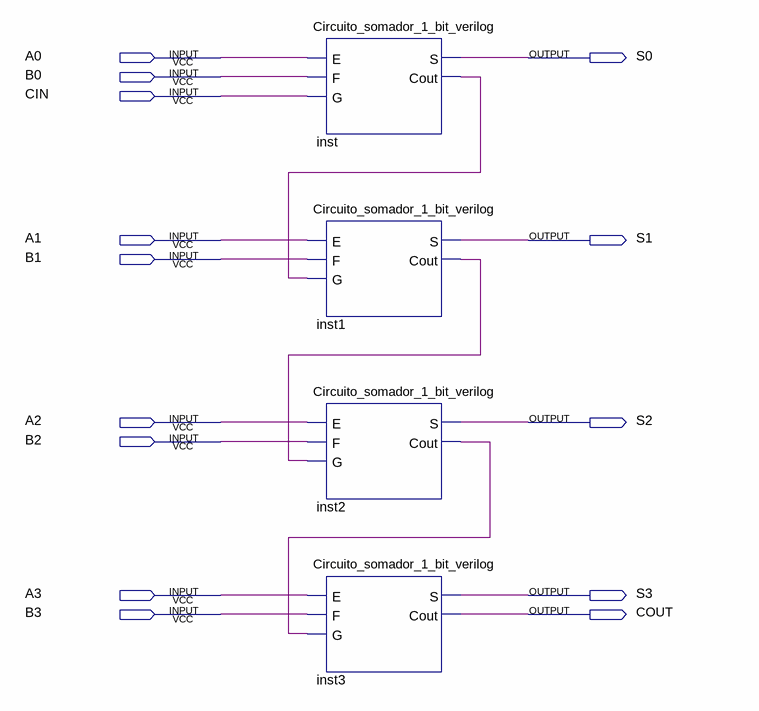
[diagram p0: schematic sheet]
// Quartus schematic somador4bit.bdf as structural Verilog: 4 symbols, 14 pins
module somador4bit (
  input  A0,
  input  B0,
  input  CIN,
  input  A1,
  input  B1,
  input  A2,
  input  B2,
  input  A3,
  input  B3,
  output S0,
  output S1,
  output S2,
  output S3,
  output COUT
);

  wire inst1_cout, inst2_cout, inst_cout;

  Circuito_somador_1_bit_verilog inst (.E(A0), .F(B0), .G(CIN), .S(S0), .Cout(inst_cout));
  Circuito_somador_1_bit_verilog inst1 (.E(A1), .F(B1), .G(inst_cout), .S(S1), .Cout(inst1_cout));
  Circuito_somador_1_bit_verilog inst2 (.E(A2), .F(B2), .G(inst1_cout), .S(S2), .Cout(inst2_cout));
  Circuito_somador_1_bit_verilog inst3 (.E(A3), .F(B3), .G(inst2_cout), .S(S3), .Cout(COUT));
endmodule
